# Altium schematic sheet SNS_INPUT.SchDoc: {Наименование}
size 420 x 297 mm; ApprovedBy: {Утвердил}; CheckedBy: {Проверил}; DrawnBy: {Разраб.}; DocumentNumber: АБВГ 123456.789 00; SheetNumber: 9; SheetTotal: {}; Scale: {Мш.}; PageSetup: Record=PageOptions|CenterHorizontal=False|CenterVertical=False|PrintScale=0.95|XCorrection=0.00|YCorrection=0.00|PrintKind=1|BorderSize=5000000|LeftOffset=0|BottomOffset=0|Orientation=1|PaperLength=1000|PaperWidth=1000|Scale=100|PaperSource=15|PrintQuality=600|MediaType=1|DitherType=10|PaperKind=A4|PrintScaleMode=1; ProcessInspection: {Т.контр.}; Mass: {М.}; NormInspection: {Н.контр.}; Letter1Column: {}; Letter2Column: {}; Letter3Column: {}; DocumentType: {Документ}; Rule: PcbType=ProtelPcb
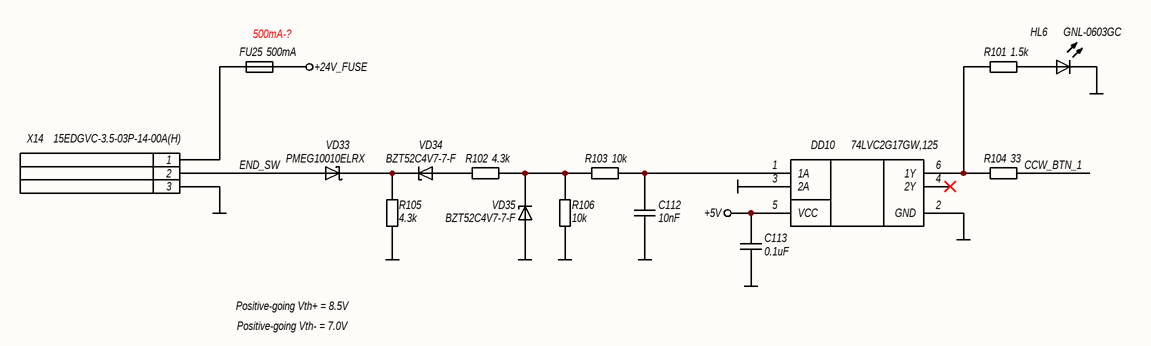
[diagram p0: SNS_INPUT.SchDoc]

## Parts
C112  10nF  [C0603N]
C113  0.1uF  [C0603N]
DD10  74LVC2G17GW,125  [SOT363-2]
FU25  500mA  [MF-MSMF]
HL6  GNL-0603GC  [LED0603]
R101  1.5k  [R0603N]
R102  4.3k  [R1206N]
R103  10k  [R0603N]
R104  33  [R0603N]
R105  4.3k  [R1206N]
R106  10k  [R0603N]
VD33  PMEG10010ELRX  [SOD123W]
VD34  BZT52C4V7-7-F  [SOD123]
VD35  BZT52C4V7-7-F  [SOD123]
X14  15EDGVC-3.5-03P-14-00A(H)  [15EDGVC-3.5-03P-14-00A(H)]

## Nets
+5V: C113.2 DD10.5(VCC)
+24V_FUSE: FU25.2
GND: C112.2 C113.1 DD10.2(GND) DD10.3(2A) HL6.1(K) R105.2 R106.2 VD35.2(A) X14.3
CCW_BTN_1: R104.1
END_SW: VD33.2(A) X14.2
NetC112_1: C112.1 DD10.1(1A) R103.1
NetDD10_6: DD10.6(1Y) R101.2 R104.2
NetFU25_1: FU25.1 X14.1
NetHL6_2: HL6.2(A) R101.1
NetR102_1: R102.1 R103.2 R106.1 VD35.1(K)
NetR102_2: R102.2 VD34.2(A)
NetR105_1: R105.1 VD33.1(K) VD34.1(K)

Not connected (* = marked no-connect by the designer): DD10 4(2Y)*

## Notes on the sheet
- (near FU25) 500mA-?
- Positive-going Vth+ = 8.5V
- Positive-going Vth- = 7.0V
- Подп. и дата
- Инв. № дубл.
- Взам. инв. №
- Инв. № подл.
- Лист
- Изм.
- № докум.
- Подп.
- Дата
- Копировал
- Формат А3

## Library data of the parts
C112 = CL10B103KB8NNNC: Конденсатор; Точность: 10%; Напряжение: 16V; Диэлектрик: X7R; Производитель: Samsung Electro-Mechanics; Описание: 10000 pF ±10% 50V Ceramic Capacitor X7R 0603 (1608 Metric); Корпус: 0603 (1608 Metric); Температурный диапазон: -55°C ~ 125°C; Вид монтажа: SMD; Артикул: CL10B103KB8NNNC; Номинал: 10nF; Строка для документации: https://mm.digikey.com/Volume0/opasdata/d220001/medias/docus/609/CL10B103KB8NNNC_Spec.pdf; Тип элемента: Конденсатор
C113 = CL10B104KB8NNNC: Конденсатор; Точность: 10%; Напряжение: 50V; Диэлектрик: X7R; Производитель: Samsung Electro-Mechanics; Описание: 0.1 µF ±10% 50V Ceramic Capacitor X7R 0603 (1608 Metric); Корпус: 0603 (1608 Metric); Температурный диапазон: -55°C ~ 125°C; Вид монтажа: SMD; Артикул: CL10B104KB8NNNC; Номинал: 0.1uF; Строка для документации: https://mm.digikey.com/Volume0/opasdata/d220001/medias/docus/609/CL10B104KB8NNNC_Spec.pdf; Тип элемента: Конденсатор
DD10 = 74LVC2G17GW,125: Микросхема сдвоенный триггер Шмитта; Производитель: Nexperia USA Inc.; Описание: Buffer, Non-Inverting 2 Element 1 Bit per Element Push-Pull Output 6-TSSOP; Корпус: 6-TSSOP; Температурный диапазон: -40°C ~ 125°C (TA); Вид монтажа: SMD; Артикул: 74LVC2G17GW,125; Строка для документации: https://assets.nexperia.com/documents/data-sheet/74LVC2G17.pdf; Тип элемента: Микросхема
FU25 = MF-MSMF050/40X-2: Плавкий предохранитель; Напряжение: 40V; Тип: PTC Resettable Fuse; Производитель: Bourns Inc.; Описание: Polymeric PTC Resettable Fuse 40V 500 mA Ih Surface Mount 1812 (4532 Metric), Concave; Корпус: 1812 (4532 Metric), Concave; Температурный диапазон: -40°C ~ 85°C; Вид монтажа: SMD; Артикул: MF-MSMF050/40X-2; Ток: 500mA; Строка для документации: https://www.bourns.com/docs/product-datasheets/mf-msmf.pdf; Тип элемента: Предохранитель
HL6 = GNL-0603GC: Светодиод; Прямой ток: 20mA; Напряжение: 2V; Яркость: 12mcd; Цвет: Зеленый; Длина волны: 567nm; Производитель: G-nor Electronics; Описание: Green 567nm LED Indication - Discrete 2V 0603 (1608 Metric); Корпус: 0603 (1608 Metric); Температурный диапазон: -40°C ~ 80°C; Вид монтажа: SMD; Тип элемента: Диод светоизлучающий; Артикул: GNL-0603GC; Строка для документации: https://www.g-nor.com/Uploads/Ed/file/20210517/1621223120713818.doc
R101 = RC0603FR-071K5L: Резистор; Точность: 1%; ТКС: ±100ppm/°C; Напряжение: 75V; Производитель: YAGEO; Описание: 1.5 kOhms ±1% 0.1W, 1/10W Chip Resistor 0603 (1608 Metric) Moisture Resistant Thick Film; Корпус: 0603 (1608 Metric); Температурный диапазон: -55°C ~ 155°C; Вид монтажа: SMD; Артикул: RC0603FR-071K5L; Номинал: 1.5k; Строка для документации: https://www.yageo.com/upload/media/product/app/datasheet/rchip/pyu-rc_group_51_rohs_l.pdf; Тип элемента: Резистор
R102 R105 = RC1206FR-074K3L: Резистор; Точность: 1%; ТКС: ±100ppm/°C; Напряжение: 75V; Производитель: YAGEO; Описание: 4.3 kOhms ±1% 0.1W, 1/10W Chip Resistor 0603 (1608 Metric) Moisture Resistant Thick Film; Корпус: 1206 (3216 Metric); Температурный диапазон: -55°C ~ 155°C; Вид монтажа: SMD; Артикул: RC1206FR-074K3L; Номинал: 4.3k; Строка для документации: https://www.yageo.com/upload/media/product/productsearch/datasheet/rchip/PYu-RC_Group_51_RoHS_L_12.pdf; Тип элемента: Резистор
R103 R106 = RC0603FR-0710KL: Резистор; Точность: 1%; ТКС: ±100ppm/°C; Напряжение: 75V; Производитель: YAGEO; Описание: 10 kOhms ±1% 0.1W, 1/10W Chip Resistor 0603 (1608 Metric) Moisture Resistant Thick Film; Корпус: 0603 (1608 Metric); Температурный диапазон: -55°C ~ 155°C; Вид монтажа: SMD; Артикул: RC0603FR-0710KL; Номинал: 10k; Строка для документации: https://www.yageo.com/upload/media/product/app/datasheet/rchip/pyu-rc_group_51_rohs_l.pdf; Тип элемента: Резистор
R104 = RC0603FR-0733RL: Резистор; Точность: 1%; ТКС: ±100ppm/°C; Напряжение: 75V; Производитель: YAGEO; Описание: 33 Ohms ±1% 0.1W, 1/10W Chip Resistor 0603 (1608 Metric) Moisture Resistant Thick Film; Корпус: 0603 (1608 Metric); Температурный диапазон: -55°C ~ 155°C; Вид монтажа: SMD; Артикул: RC0603FR-0733RL; Номинал: 33; Строка для документации: https://www.yageo.com/upload/media/product/app/datasheet/rchip/pyu-rc_group_51_rohs_l.pdf; Тип элемента: Резистор
VD33 = PMEG10010ELRX: Диод Шоттки; Прямой ток: 1A; Напряжение: 100V; Производитель: Nexperia USA Inc.; Описание: Diode 100 V 1A Surface Mount SOD-123W; Корпус: SOD-123W; Температурный диапазон: -40°C ~ 175°C; Вид монтажа: SMD; Артикул: PMEG10010ELRX; Тип: Schottky; Строка для документации: https://assets.nexperia.com/documents/data-sheet/PMEG10010ELR.pdf; Тип элемента: Диод
VD34 VD35 = BZT52C4V7-7-F: Стабилитрон; Прямой ток: 5mA; Напряжение: 4.7V; Производитель: Diodes Incorporated; Описание: Zener Diode 4.7 V 500 mW ±6% Surface Mount SOD-123; Корпус: SOD-123; Температурный диапазон: -65°C ~ 150°C; Вид монтажа: SMD; Тип элемента: Диод; Артикул: BZT52C4V7-7-F; Тип: Zener; Строка для документации: https://www.diodes.com/assets/Datasheets/ds18010.pdf
X14 = 15EDGVC-3.5-03P-14-00A(H): Разъем, 3 контакта; Тип разъема: Pluggable terminal block; Количество контактов: 3; Шаг контактов: 3.5mm; Ток: 7A; Напряжение: 250V; Производитель: Degson Electronics; Описание: Pluggable terminal block; 3.5mm; ways: 3; straight; socket; male; Температурный диапазон: -40°C ~ 105°C; Вид монтажа: Through Hole; Артикул: 15EDGVC-3.5-03P-14-00A(H); Строка для документации: https://www.tme.eu/Document/83e7173fe653a2d0e44585e87978945b/opr014R8.pdf; Тип элемента: Разъем